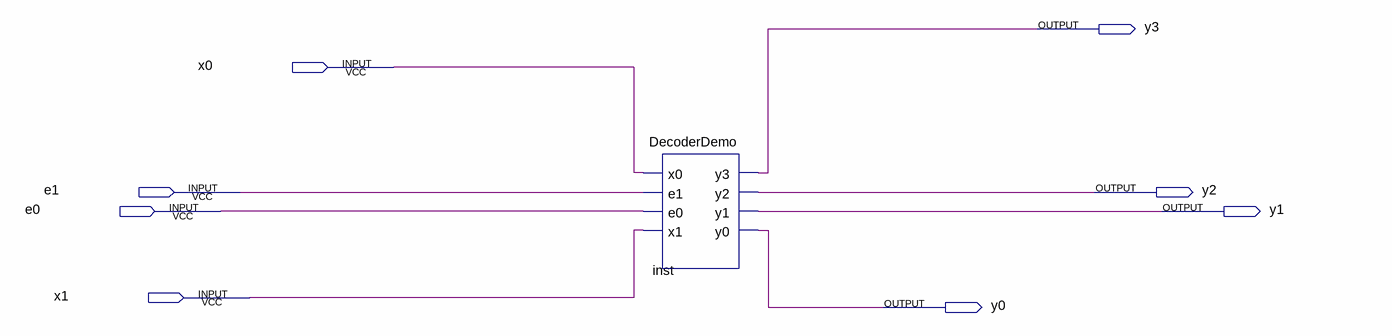
[diagram p0: schematic sheet]
// Quartus schematic DecoderDemo2.bdf as structural Verilog: 1 symbols, 8 pins
module DecoderDemo2 (
  input  x0,
  input  e1,
  input  e0,
  input  x1,
  output y3,
  output y2,
  output y1,
  output y0
);

  DecoderDemo inst (.x0(x0), .e1(e1), .e0(e0), .x1(x1), .y3(y3), .y2(y2), .y1(y1), .y0(y0));
endmodule
